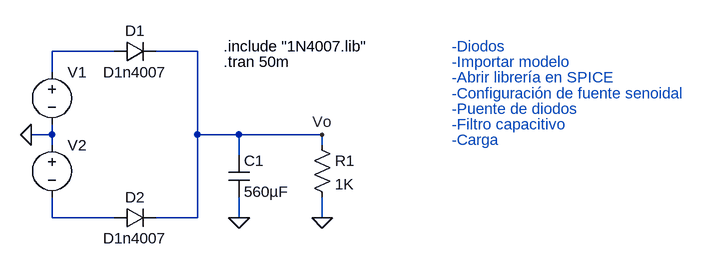
[diagram p0: schematic halfBridgeRectifier.asc]
halfBridgeRectifier.asc, the LTspice schematic file:
Version 4
SHEET 1 896 680
WIRE -320 64 -416 64
WIRE -192 64 -256 64
WIRE -416 96 -416 64
WIRE -416 192 -416 176
WIRE -416 192 -448 192
WIRE -192 192 -192 64
WIRE -128 192 -192 192
WIRE 0 192 -128 192
WIRE -416 208 -416 192
WIRE 0 208 0 192
WIRE -128 224 -128 192
WIRE -416 320 -416 288
WIRE -320 320 -416 320
WIRE -192 320 -192 192
WIRE -192 320 -256 320
WIRE -128 320 -128 288
WIRE 0 320 0 288
FLAG -448 192 0
FLAG 0 192 Vo
FLAG -128 320 0
FLAG 0 320 0
SYMBOL voltage -416 80 R0
WINDOW 3 24 96 Invisible 2
WINDOW 123 0 0 Left 0
WINDOW 39 0 0 Left 0
SYMATTR Value SINE(0 12 60)
SYMATTR InstName V1
SYMBOL voltage -416 192 R0
WINDOW 3 24 96 Invisible 2
WINDOW 123 0 0 Left 0
WINDOW 39 0 0 Left 0
SYMATTR Value SINE(0 12 60)
SYMATTR InstName V2
SYMBOL diode -320 80 R270
WINDOW 0 32 32 VTop 2
WINDOW 3 0 32 VBottom 2
SYMATTR InstName D1
SYMATTR Value D1n4007
SYMBOL diode -320 336 R270
WINDOW 0 32 32 VTop 2
WINDOW 3 0 32 VBottom 2
SYMATTR InstName D2
SYMATTR Value D1n4007
SYMBOL cap -144 224 R0
SYMATTR InstName C1
SYMATTR Value 560µF
SYMBOL res -16 192 R0
SYMATTR InstName R1
SYMATTR Value 1K
TEXT -152 56 Left 2 !.include "1N4007.lib"
TEXT -152 80 Left 2 !.tran 50m
TEXT 200 56 Left 2 ;-Diodos
TEXT 200 80 Left 2 ;-Importar modelo
TEXT 200 128 Left 2 ;-Configuración de fuente senoidal
TEXT 200 152 Left 2 ;-Puente de diodos
TEXT 200 176 Left 2 ;-Filtro capacitivo
TEXT 200 200 Left 2 ;-Carga
TEXT 200 104 Left 2 ;-Abrir librería en SPICE

The netlist it stands for:
* halfBridgeRectifier.asc
V1 N001 0 SINE(0 12 60)
V2 0 N002 SINE(0 12 60)
D1 N001 Vo D1n4007
D2 N002 Vo D1n4007
C1 Vo 0 560µF
R1 Vo 0 1K
.model D D
.lib standard.dio
.include "1N4007.lib"
.tran 50m
* -Diodos
* -Importar modelo
* -Configuración de fuente senoidal
* -Puente de diodos
* -Filtro capacitivo
* -Carga
* -Abrir librería en SPICE
.backanno
.end